# EAGLE design MSP-EXPG2_Rev.1.3 (EAGLE 5.01)

## Sheet 1 of 3
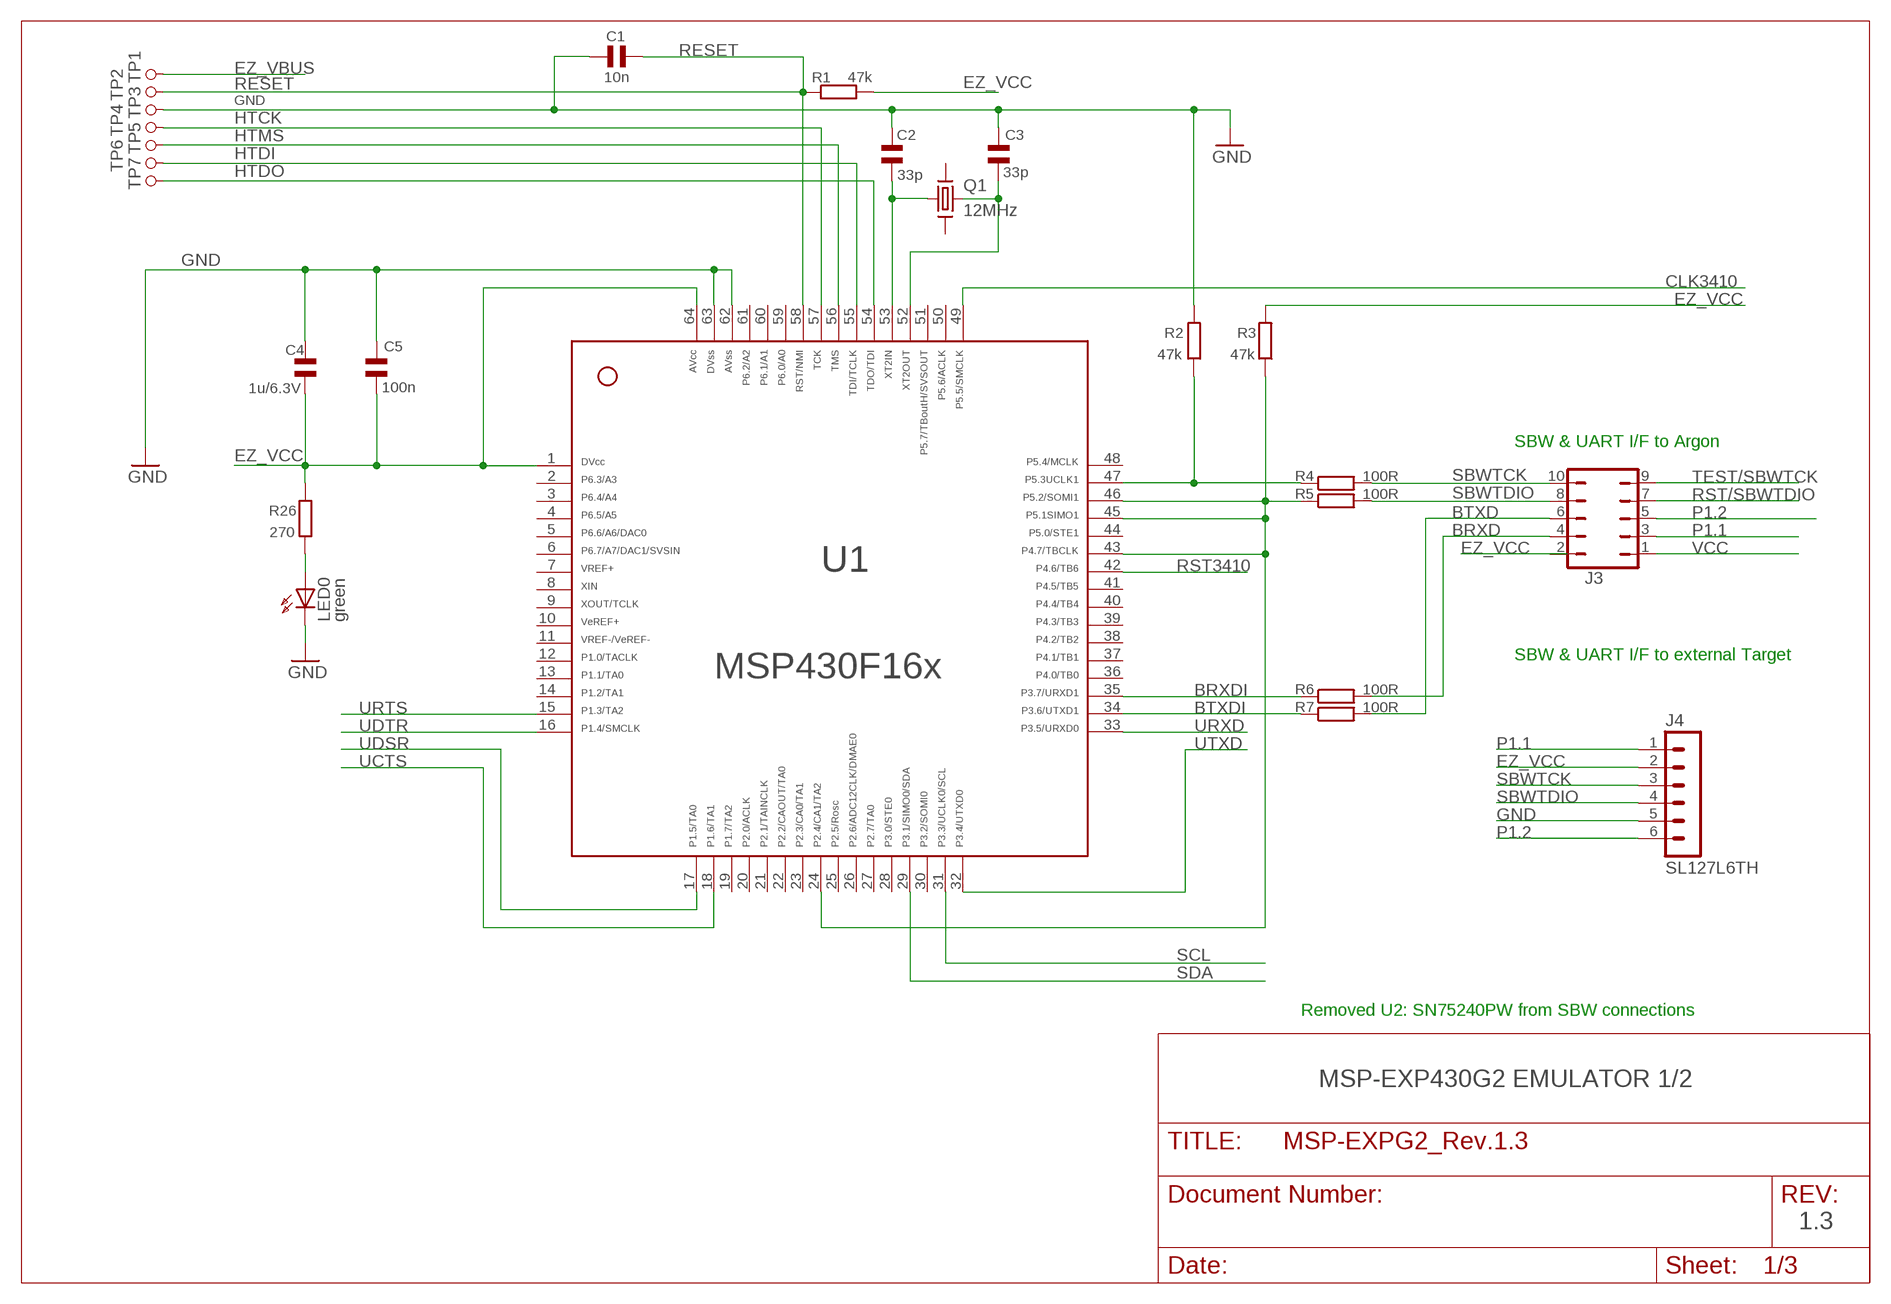
[diagram p0: schematic, sheet 1]

### Parts
C1  10n  C_SMD0402  [0402]
C2  33p  C_SMD0402  [0402]
C3  33p  C_SMD0402  [0402]
C4  1u/6.3V  C_SMD0603  [0603]
C5  100n  C_SMD0402  [0402]
J3  JP5Q  [JP5Q]
J4  SL127L6TH  [SL127L6_MPE]
LED0  green  LED_0603D0603  [DIODE0603]
Q1  12MHz  XTL_FT7AFT10A  [FT10A]
R1  47k  R_SMDR0402  [0402]
R2  47k  R_SMDR0402  [0402]
R3  47k  R_SMDR0402  [0402]
R4  100R  R_SMDR0402  [0402]
R5  100R  R_SMDR0402  [0402]
R6  100R  R_SMDR0402  [0402]
R7  100R  R_SMDR0402  [0402]
R26  270  R_SMDR0402  [0402]
TP1  TP05TP10  [TP10]
TP2  TP05TP10  [TP10]
TP3  TP05TP10  [TP10]
TP4  TP05TP10  [TP10]
TP5  TP05TP10  [TP10]
TP6  TP05TP10  [TP10]
TP7  TP05TP10  [TP10]
U1  F16X---PM64  [PM/PAG64]

### Nets
BRXD: J3.4 R6.2
BRXDI: R6.1 U1.35 ; also sheet 2
BTXD: J3.6 R7.2
BTXDI: R7.1 U1.34 ; also sheet 2
CLK3410: U1.49 ; also sheet 2
EZ_VBUS: TP1.1 ; also sheet 2
EZ_VCC: C4.2 C5.1 J3.2 J4.2 R1.2 R3.2 R26.2 U1.1 U1.64 ; also sheet 2
GND [Ground]: C1.2 C2.2 C3.2 C4.1 C5.2 J4.5 LED0.K(C) R2.2 TP3.1 U1.62 U1.63 ; also sheet 2,3
HTCK: TP4.1 U1.57
HTDI: TP6.1 U1.55
HTDO: TP7.1 U1.54
HTMS: TP5.1 U1.56
N$1: R2.1 R4.1 U1.47
N$2: R3.1 R5.1 U1.24 U1.43 U1.45 U1.46
N$19: LED0.A R26.1
P1.1: J3.3 J4.1 ; also sheet 3
P1.2: J3.5 J4.6 ; also sheet 3
RESET: C1.1 R1.1 TP2.1 U1.58 ; also sheet 2
RST3410: U1.42 ; also sheet 2
RST/SBWTDIO: J3.7 ; also sheet 3
SBWTCK: J3.10 J4.3 R4.2
SBWTDIO: J3.8 J4.4 R5.2
SCL: U1.31 ; also sheet 2
SDA: U1.29 ; also sheet 2
TEST/SBWTCK: J3.9 ; also sheet 3
UCTS: U1.18 ; also sheet 2
UDSR: U1.17 ; also sheet 2
UDTR: U1.16 ; also sheet 2
URTS: U1.15 ; also sheet 2
URXD: U1.33 ; also sheet 2
UTXD: U1.32 ; also sheet 2
VCC: J3.1 ; also sheet 3
XIN1: C3.1 Q1.P$3 U1.52
XOUT1: C2.1 Q1.P$1 U1.53
Unconnected: Q1.P$2(G2) Q1.P$4(G4) U1.2 U1.3 U1.4 U1.5 U1.6 U1.7 U1.8 U1.9 U1.10 U1.11 U1.12 U1.13 U1.14 U1.19 U1.20 U1.21 U1.22 U1.23 U1.25 U1.26 U1.27 U1.28 U1.30 U1.36 U1.37 U1.38 U1.39 U1.40 U1.41 U1.44 U1.48 U1.50 U1.51 U1.59 U1.60 U1.61

### Notes on the sheet
- SBW & UART I/F to Argon
- SBW & UART I/F to external Target
- Removed U2: SN75240PW from SBW connections
- MSP-EXP430G2 EMULATOR 1/2
- 1.3

## Sheet 2 of 3
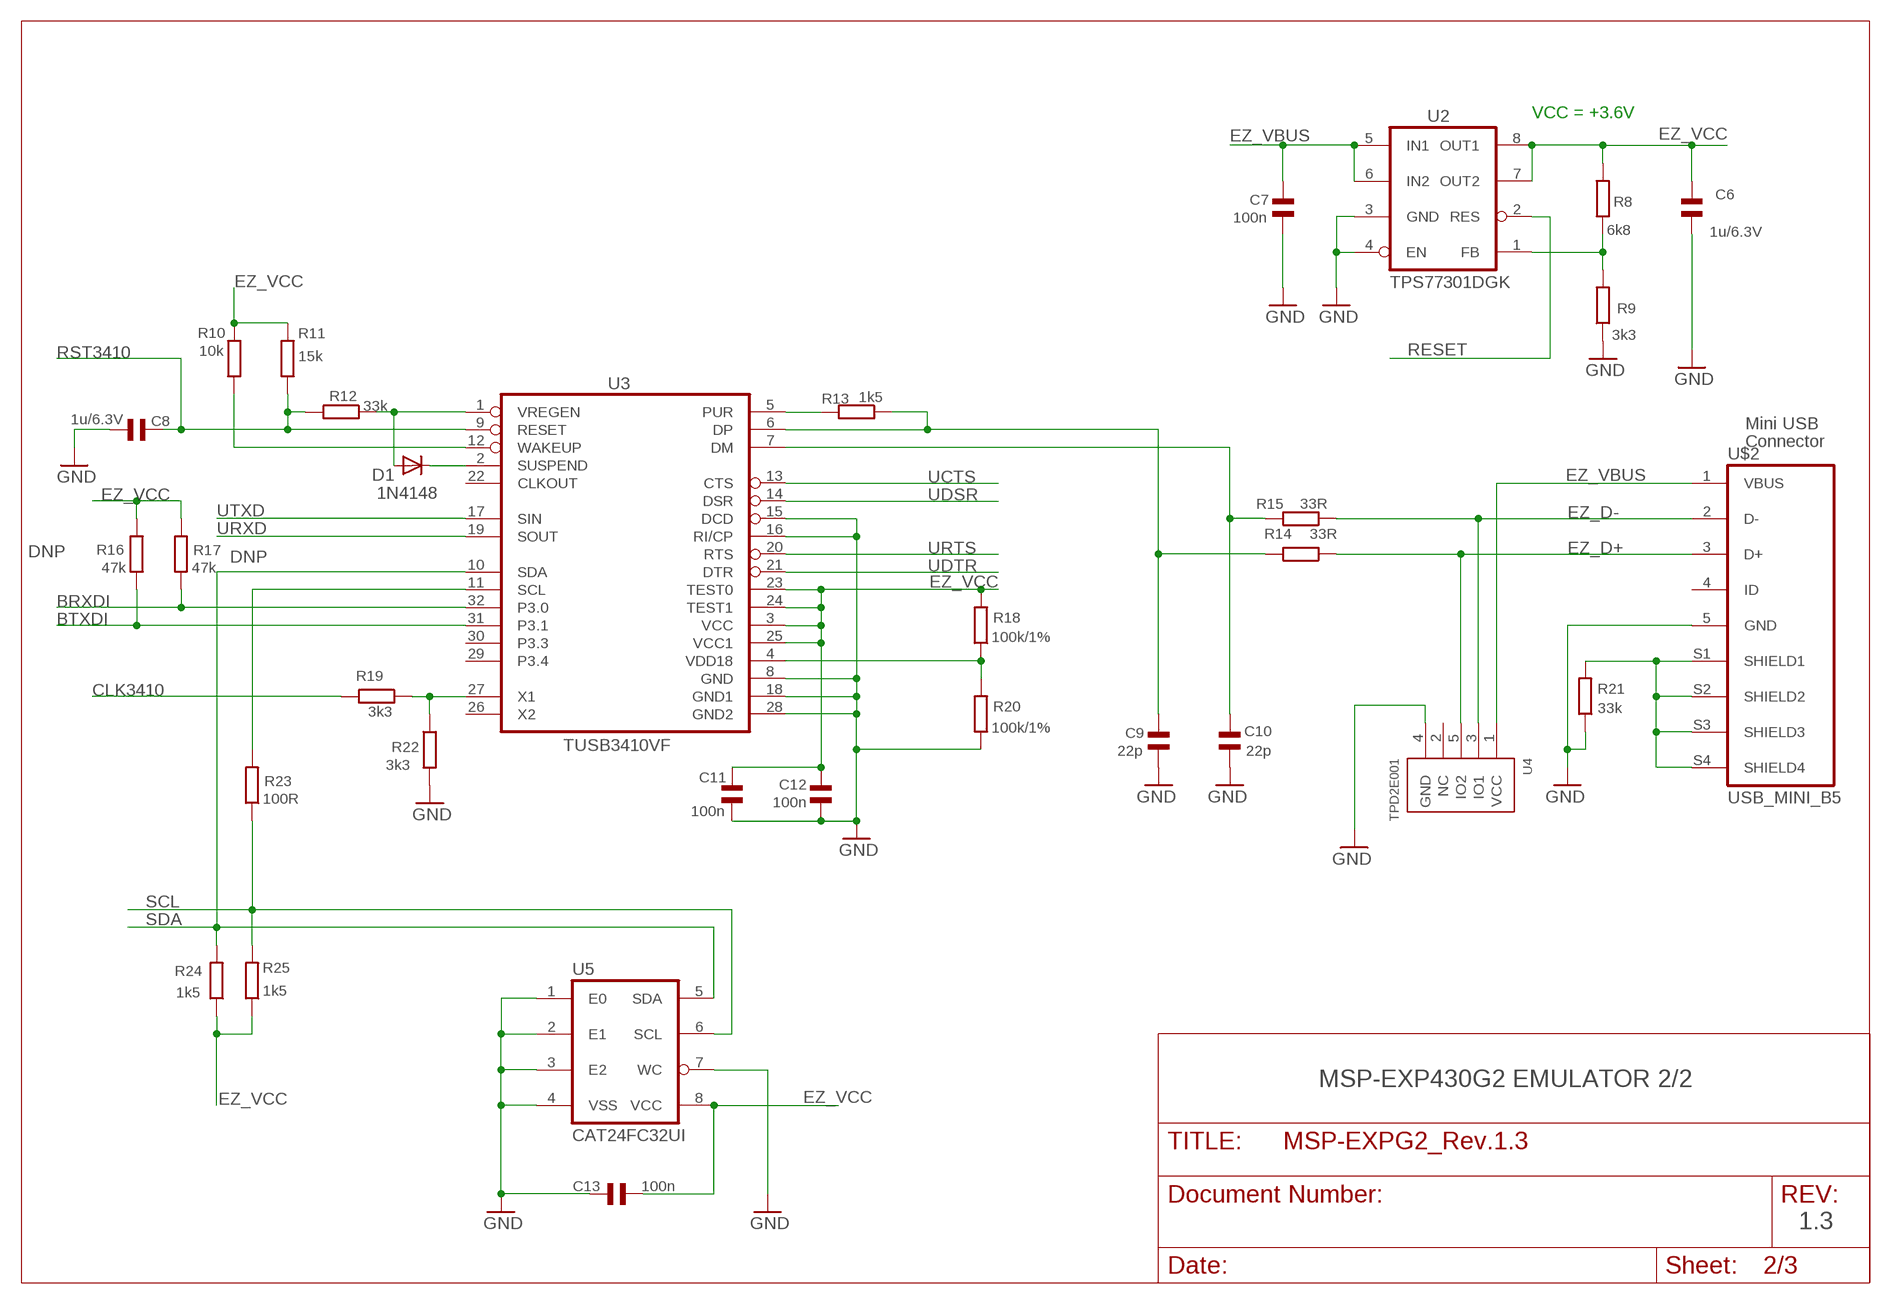
[diagram p1: schematic, sheet 2]

### Parts
C6  1u/6.3V  C_SMD0603  [0603]
C7  100n  C_SMD0402  [0402]
C8  1u/6.3V  C_SMD0603  [0603]
C9  22p  C_SMD0402  [0402]
C10  22p  C_SMD0402  [0402]
C11  100n  C_SMD0402  [0402]
C12  100n  C_SMD0402  [0402]
C13  100n  C_SMD0402  [0402]
D1  1N4148  DIODE-SOD110-R  [SOD110-R]
R8  6k8  R_SMDR0402  [0402]
R9  3k3  R_SMDR0402  [0402]
R10  10k  R_SMDR0402  [0402]
R11  15k  R_SMDR0402  [0402]
R12  33k  R_SMDR0402  [0402]
R13  1k5  R_SMDR0402  [0402]
R14  33R  R_SMDR0402  [0402]
R15  33R  R_SMDR0402  [0402]
R16  47k  R_SMDR0402  [0402]
R17  47k  R_SMDR0402  [0402]
R18  100k/1%  R_SMDR0402  [0402]
R19  3k3  R_SMDR0402  [0402]
R20  100k/1%  R_SMDR0402  [0402]
R21  33k  R_SMDR0402  [0402]
R22  3k3  R_SMDR0402  [0402]
R23  100R  R_SMDR0402  [0402]
R24  1k5  R_SMDR0402  [0402]
R25  1k5  R_SMDR0402  [0402]
U2  TPS77301DGK  TPS773XX  [MSOP8]
U3  TUSB3410VF  TUSB3410  [QFP32]
U4  TPD2E001  [TPD2E001-DRL]
U5  CAT24FC32UI  M24XXX  [TSSOP8]
U$2  USB_MINI_B5  [USB_MINI_B]

### Nets
BRXDI: R17.1 U3.32(P3.0) ; also sheet 1
BTXDI: R16.1 U3.31(P3.1) ; also sheet 1
CLK3410: R19.2 ; also sheet 1
EZ_D+: R14.1 U4.5(IO2) U$2.3(D+)
EZ_D-: R15.1 U4.3(IO1) U$2.2(D-)
EZ_VBUS: C7.2 U2.5(IN1) U2.6(IN2) U4.1(VCC) U$2.1(VBUS) ; also sheet 1
EZ_VCC: C6.1 C11.2 C12.2 C13.1 R8.2 R10.2 R11.2 R16.2 R17.2 R18.2 R24.1 R25.1 U2.7(OUT2) U2.8(OUT1) U3.3(VCC) U3.23(TEST0) U3.24(TEST1) U3.25(VCC1) U5.8(VCC) ; also sheet 1
GND [Ground]: C6.2 C7.1 C8.2 C9.1 C10.1 C11.1 C12.1 C13.2 R9.1 R20.1 R21.1 R22.2 U2.3(GND) U2.4(EN) U3.8(GND) U3.15(DCD) U3.16(RI/CP) U3.18(GND1) U3.28(GND2) U4.4(GND) U5.1(E0) U5.2(E1) U5.3(E2) U5.4(VSS) U5.7(WC) U$2.5(GND) ; also sheet 1,3
N$3: R19.1 R22.1 U3.27(X1)
N$4: R8.1 R9.2 U2.1(FB)
N$5: D1.A R12.1 U3.1(VREGEN)
N$6: D1.C U3.2(SUSPEND)
N$9: R10.1 U3.12(WAKEUP)
N$16: R23.2 U3.11(SCL)
N$17: R18.1 R20.2 U3.4(VDD18)
N$22: R21.2 U$2.S1(SHIELD1) U$2.S2(SHIELD2) U$2.S3(SHIELD3) U$2.S4(SHIELD4)
N$26: R13.2 U3.5(PUR)
N$30: C10.2 R15.2 U3.7(DM)
N$31: C9.2 R13.1 R14.2 U3.6(DP)
RESET: U2.2(RES) ; also sheet 1
RST3410: C8.1 R11.1 R12.2 U3.9(RESET) ; also sheet 1
SCL: R23.1 R25.2 U5.6(SCL) ; also sheet 1
SDA: R24.2 U3.10(SDA) U5.5(SDA) ; also sheet 1
UCTS: U3.13(CTS) ; also sheet 1
UDSR: U3.14(DSR) ; also sheet 1
UDTR: U3.21(DTR) ; also sheet 1
URTS: U3.20(RTS) ; also sheet 1
URXD: U3.19(SOUT) ; also sheet 1
UTXD: U3.17(SIN) ; also sheet 1
Unconnected: U3.22(CLKOUT) U3.26(X2) U3.29(P3.4) U3.30(P3.3) U4.2(NC)

### Notes on the sheet
- VCC = +3.6V
- Mini USB
- Connector
- DNP
- DNP
- MSP-EXP430G2 EMULATOR 2/2
- 1.3

## Sheet 3 of 3
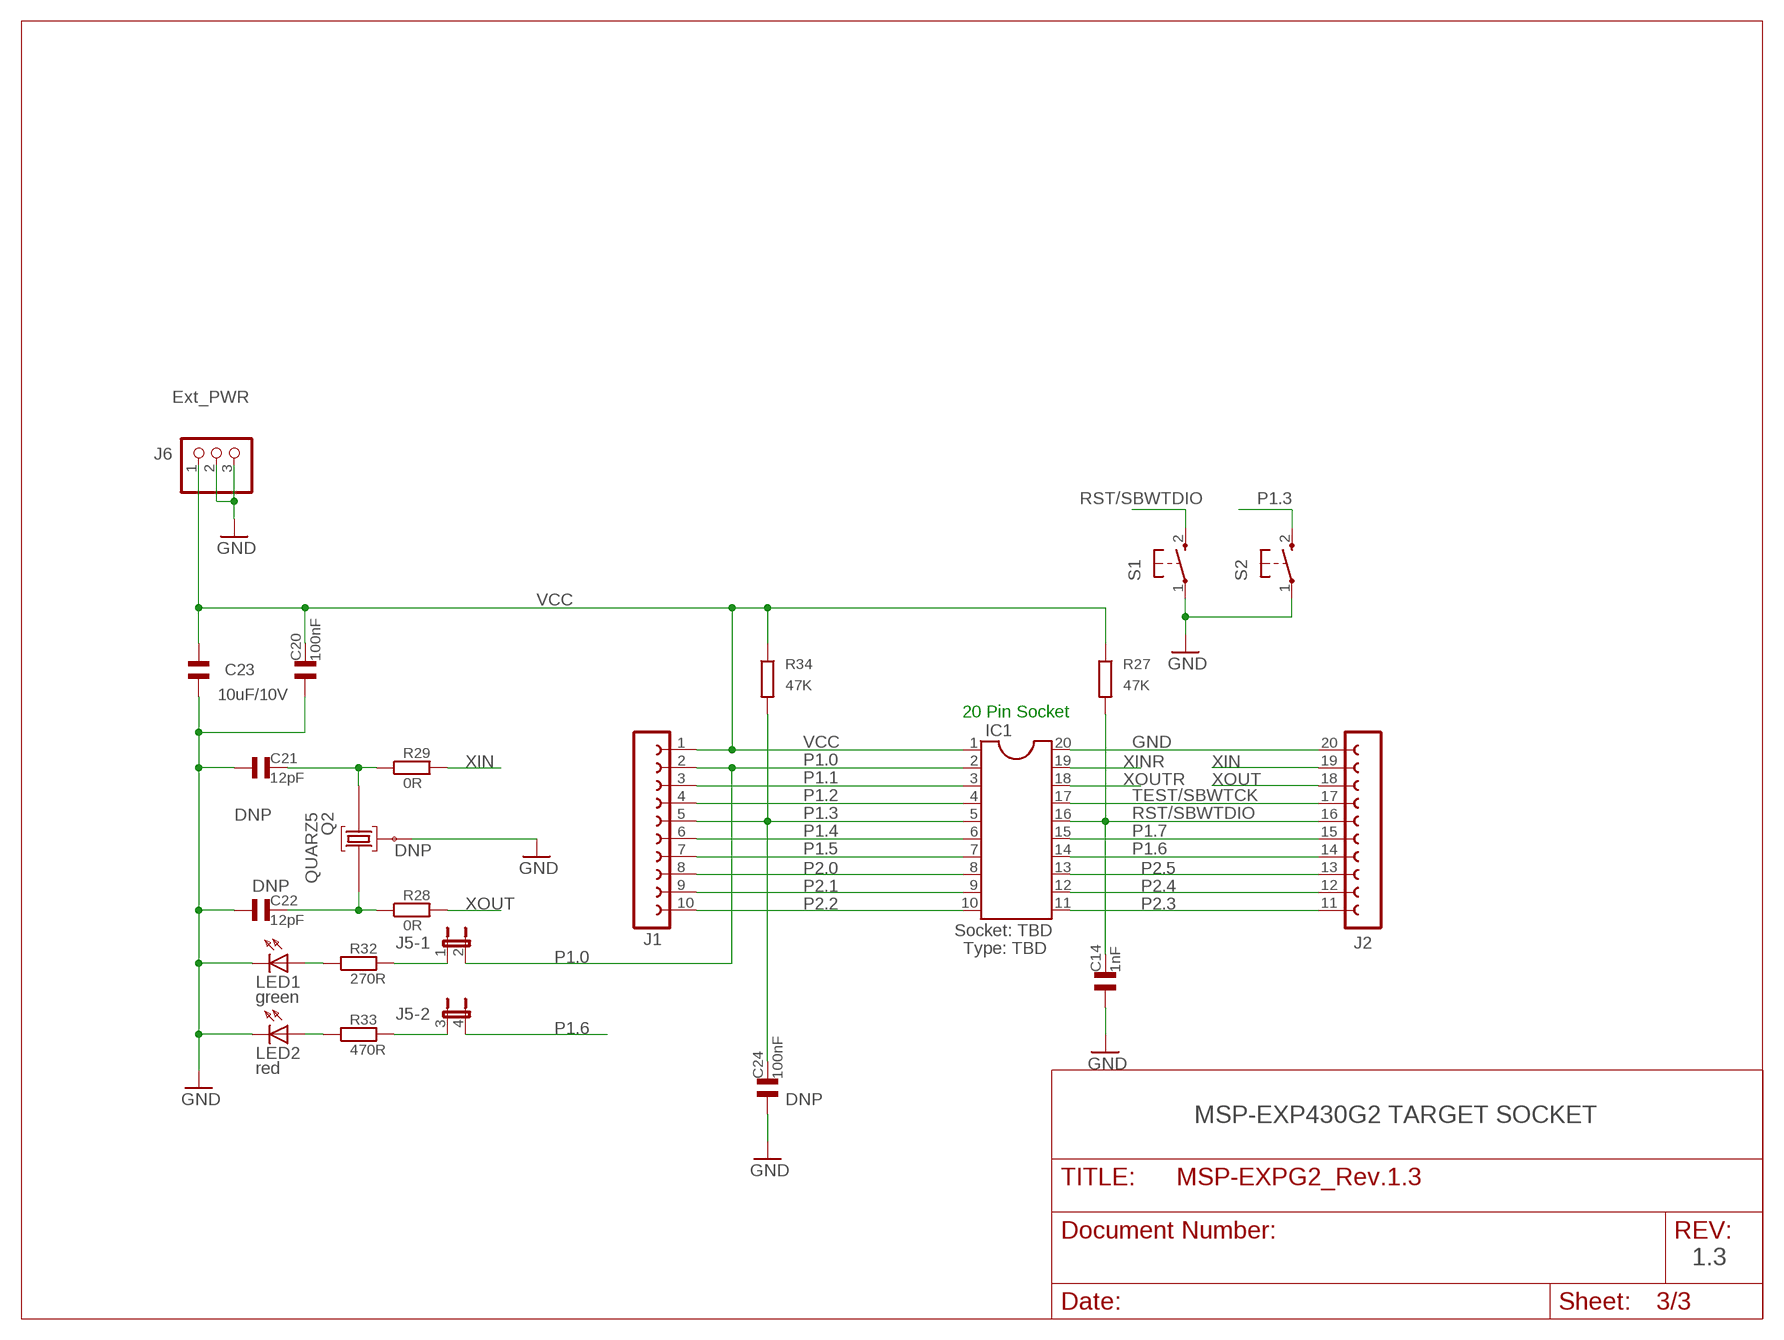
[diagram p2: schematic, sheet 3]

### Parts
C14  1nF  C_SMD0603  [0603]
C20  100nF  C_SMD0603  [0603]
C21  12pF  C_SMD0603  [0603]
C22  12pF  C_SMD0603  [0603]
C23  10uF/10V  C_0805  [0805]
C24  100nF  C_SMD0603  [0603]
IC1  DIL20  [DIL20]
J1  FE10L  [FE10]
J2  FE10H  [FE10H]
J5  JP2QE  [JP2Q]
J6  PINHD-1X3  [1X03]
LED1  green  LED_0603D0603  [DIODE0603]
LED2  red  LED_0603D0603  [DIODE0603]
Q2  QUARZ5  [QUARZ5]
R27  47K  R_SMDR0603  [0603]
R28  0R  R_SMDR0603  [0603]
R29  0R  R_SMDR0603  [0603]
R32  270R  R_SMDR0603  [0603]
R33  470R  R_SMDR0603  [0603]
R34  47K  R_SMDR0603  [0603]
S1  PB  [PBTH]
S2  PB  [PBTH]

### Nets
GND [Ground]: C14.1 C20.1 C21.1 C22.1 C23.1 C24.1 IC1.20 J2.20 J6.2 J6.3 LED1.K(C) LED2.K(C) Q2.GND@0 S1.1(P) S2.1(P) ; also sheet 1,2
N$14: LED2.A R33.1
N$15: J5.3 R33.2
N$33: J5.1 R32.2
N$34: LED1.A R32.1
P1.0: IC1.2 J1.2 J5.2
P1.1: IC1.3 J1.3 ; also sheet 1
P1.2: IC1.4 J1.4 ; also sheet 1
P1.3: C24.2 IC1.5 J1.5 R34.2 S2.2(S)
P1.4: IC1.6 J1.6
P1.5: IC1.7 J1.7
P1.6: IC1.14 J2.14 J5.4
P1.7: IC1.15 J2.15
P2.0: IC1.8 J1.8
P2.1: IC1.9 J1.9
P2.2: IC1.10 J1.10
P2.3: IC1.11 J2.11
P2.4: IC1.12 J2.12
P2.5: IC1.13 J2.13
RST/SBWTDIO: C14.2 IC1.16 J2.16 R27.2 S1.2(S) ; also sheet 1
TEST/SBWTCK: IC1.17 J2.17 ; also sheet 1
VCC: C20.2 C23.2 IC1.1 J1.1 J6.1 R27.1 R34.1 ; also sheet 1
XIN: J2.19 R29.2
XINR: C21.2 IC1.19 Q2.2 R29.1
XOUT: J2.18 R28.2
XOUTR: C22.2 IC1.18 Q2.1 R28.1

### Notes on the sheet
- Ext_PWR
- 20 Pin Socket
- DNP
- DNP
- DNP
- Socket: TBD
- Type: TBD
- DNP
- MSP-EXP430G2 TARGET SOCKET
- 1.3

## Power pins joined to a net without a drawn wire
ID: U$2.4(ID)

## Library data of the parts
C1-C13 = smd:C_SMD
C14 C20-C22 C24 = ssmd:C_SMD
C23 = ssmd:C_0805
D1 = diode:DIODE-: DIODE
IC1 = ic-package:DIL20: Dual In Line / Socket
J1 = sMSP430:FE10L
J2 = sMSP430:FE10H
J3 = sTI Lib:JP5Q: JUMPER
J4 = susbfet:SL127L6TH
J5 = stexas:JP2QE: JUMPER
J6 = pinhead:PINHD-1X3: PIN HEADER
LED0 LED1 LED2 = smd:LED_0603
Q1 = susbfet:XTL_FT7A
Q2 = sMSP430:QUARZ5
R1-R26 = smd:R_SMD
R27-R29 R32-R34 = ssmd:R_SMD
S1 S2 = electricalmeter:PB: OMRON SWITCH
TP1-TP7 = usbfet:TP05
U1 = TI_MSP430_v11:F16X---PM64: *** MSP430F16x *** PM64
U2 = gangprog:TPS773XX: VReg, 250mA
U3 = usbfet:TUSB3410: TI: TUSB3410: USB2UART-Controller
U4 = Project7264:TPD2E001: TPD2E001 ESD-protection diode array
U5 = usbfet:M24XXX: Serial EEProm: 24LC xxx
U$2 = susbfet:USB_MINI_B5

## Net classes
0 default: width 0.254 mm
1 Ground: width 0.1 mm, drill 0.2 mm

## Board
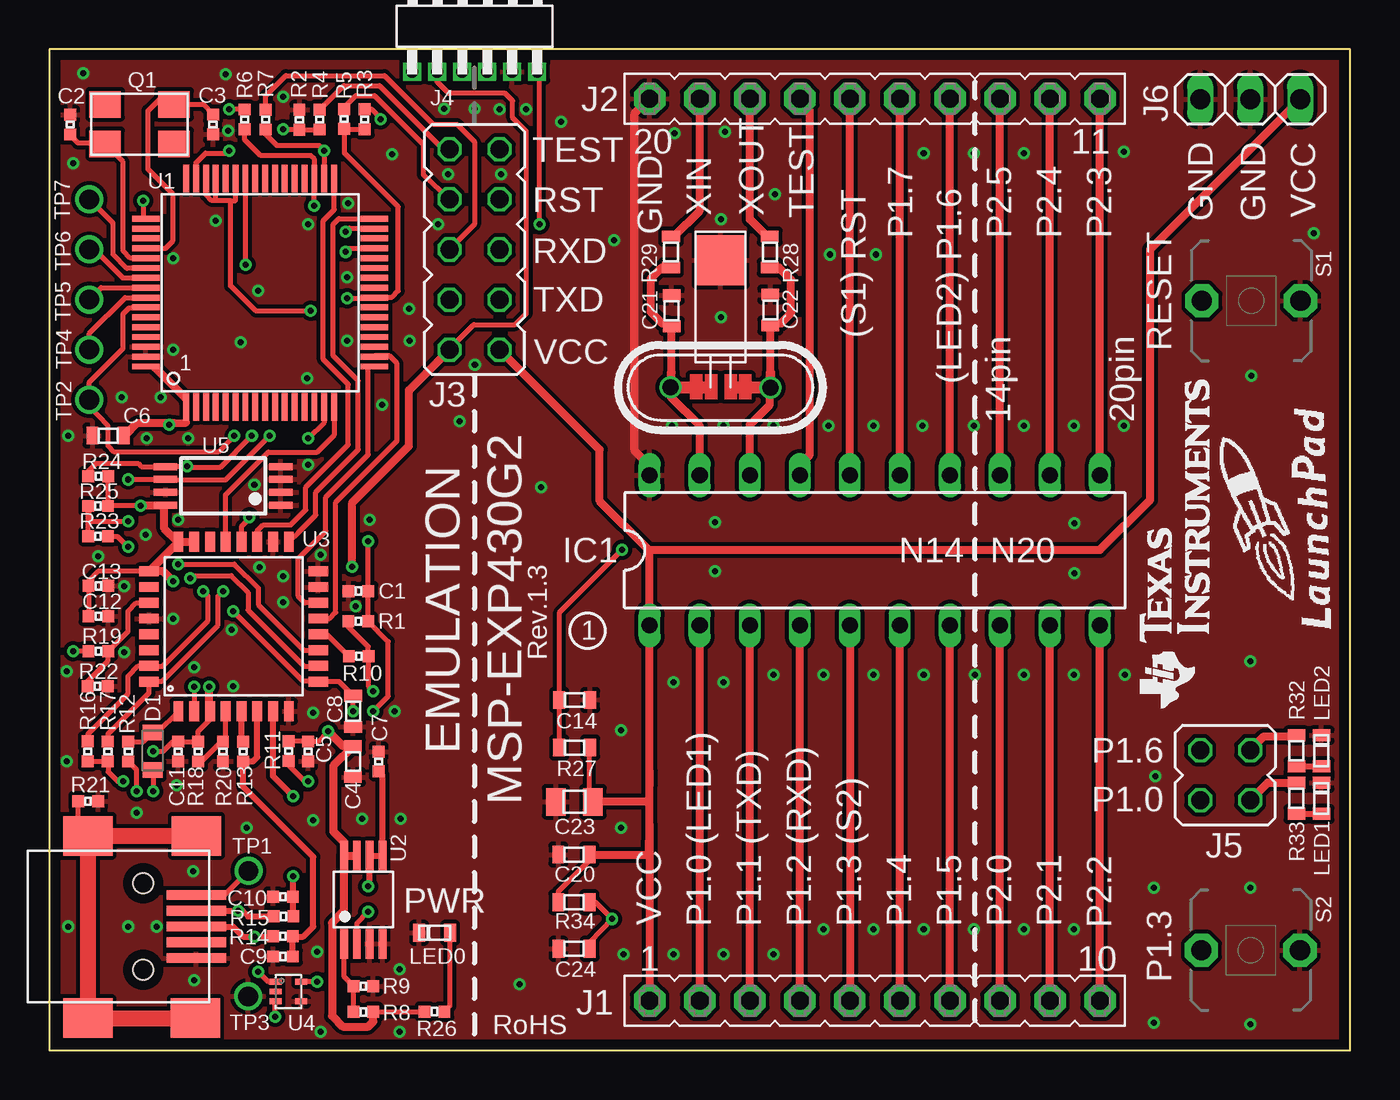
[diagram p3: board, top side]
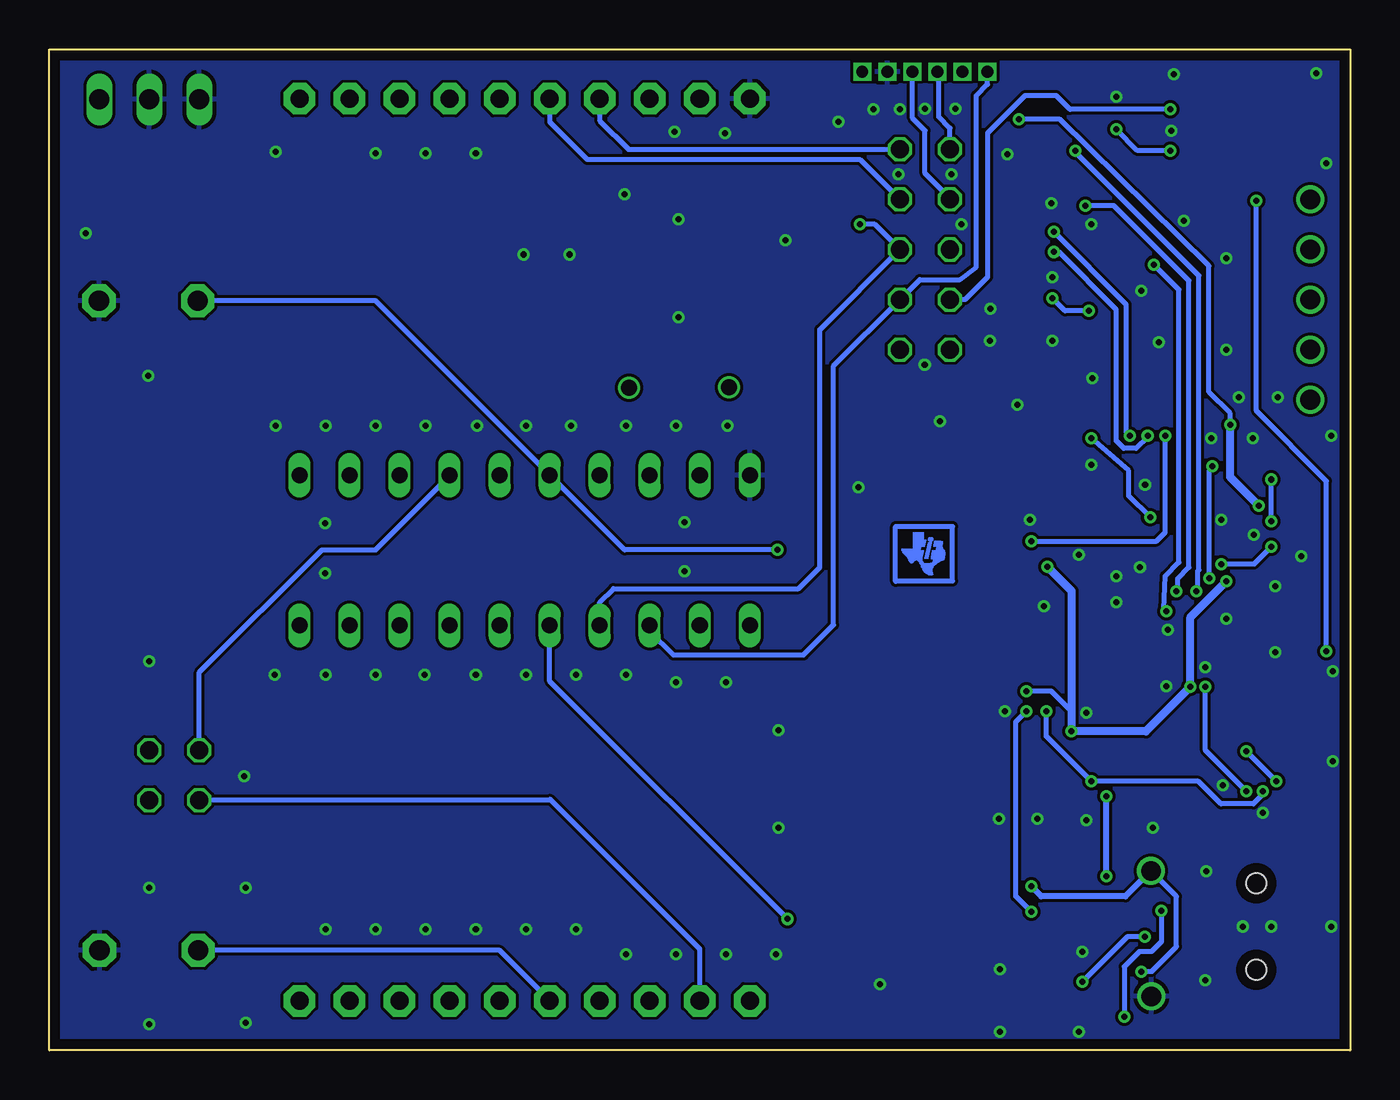
[diagram p4: board, bottom side, seen from below]

Size 66.04 x 50.8 mm. Coordinates in mm from the lower left corner, seen from the top.
Outline: 0,0 66.04,0 66.04,50.8 0,50.8 0,0
Copper layers (1*16): Top 0.035mm / dielectric 1.5mm / Bottom 0.035mm
Design rules "PCB-POOL *": minimum track width 6mil, minimum drill 12mil, track to track 6mil, track to pad 6mil, pad to pad 6mil, via to via 6mil, smd to smd 6mil, copper to edge 20mil, drill to drill 8mil, minimum pad ring 6mil, minimum via ring 6mil, stop-mask expansion 3mil, vias tented up to drill 0mil, thermal gap 8mil

### Footprints (pad centres in the part's own frame; a part is rotated, then mirrored left to right if it is on the bottom)
0402 = smd 0.6 x 0.6: 1 -0.501,0; 2 0.501,0
0603 = smd 0.6 x 0.9: 1 -0.787,0; 2 0.787,0
0805 = smd 1 x 1.4: 1 -0.94,0; 2 0.94,0
SOD110-R = smd 0.8 x 1: A 0.95,0; C -0.95,0
DIL20 = drill 0.813 long: 1 -11.43,-3.81; 2 -8.89,-3.81; 3 -6.35,-3.81; 4 -3.81,-3.81; 5 -1.27,-3.81; 6 1.27,-3.81; 7 3.81,-3.81; 8 6.35,-3.81; 9 8.89,-3.81; 10 11.43,-3.81; 11 11.43,3.81; 12 8.89,3.81; 13 6.35,3.81; 14 3.81,3.81; 15 1.27,3.81; 16 -1.27,3.81; 17 -3.81,3.81; 18 -6.35,3.81; 19 -8.89,3.81; 20 -11.43,3.81
FE10 = drill 0.914 pad 1.6 octagon: 1 -11.43,0; 2 -8.89,0; 3 -6.35,0; 4 -3.81,0; 5 -1.27,0; 6 1.27,0; 7 3.81,0; 8 6.35,0; 9 8.89,0; 10 11.43,0
FE10H = drill 0.914 pad 1.6 octagon: 11 -11.43,0; 12 -8.89,0; 13 -6.35,0; 14 -3.81,0; 15 -1.27,0; 16 1.27,0; 17 3.81,0; 18 6.35,0; 19 8.89,0; 20 11.43,0
JP5Q = drill 0.914 octagon: 1 -5.08,-1.27; 2 -5.08,1.27; 3 -2.54,-1.27; 4 -2.54,1.27; 5 0,-1.27; 6 0,1.27; 7 2.54,-1.27; 8 2.54,1.27; 9 5.08,-1.27; 10 5.08,1.27
SL127L6_MPE = drill 0.6 pad 0.889 square: 1 -3.17,0.07; 2 -1.91,0.07; 3 -0.63,0.07; 4 0.63,0.07; 5 1.91,0.07; 6 3.18,0.07
JP2Q = drill 0.914 octagon: 1 -1.27,-1.27; 2 -1.27,1.27; 3 1.27,-1.27; 4 1.27,1.27
1X03 = drill 1.016 long: 1 -2.54,0; 2 0,0; 3 2.54,0
DIODE0603 = smd 0.6 x 0.9: A -0.787,0; K 0.787,0
FT10A = smd 1.6 x 1.35: P$1 -1.75,-1; P$2 1.75,-1; P$3 1.75,1; P$4 -1.75,1
QUARZ5 = drill 0.813 round: 1 1.53,1.773; 2 1.52,-3.303 | smd 2.54 x 2.54: GND@0 -4.941,-0.762
PBTH = drill 1.016 pad 1.676 octagon: 1 -0.001,0.001; 2 5.001,0.001
TP10 = drill 1 pad 1.422 round: 1 0,0
PM/PAG64 = smd 1.4 x 0.3: 1 -5.88,3.67; 2 -5.88,3.17; 3 -5.88,2.67; 4 -5.88,2.17; 5 -5.88,1.67; 6 -5.88,1.17; 7 -5.88,0.67; 8 -5.88,0.17; 9 -5.88,-0.33; 10 -5.88,-0.83; 11 -5.88,-1.33; 12 -5.88,-1.83; 13 -5.88,-2.33; 14 -5.88,-2.83; 15 -5.88,-3.33; 16 -5.88,-3.83; 33 5.72,-3.83; 34 5.72,-3.33; 35 5.72,-2.83; 36 5.72,-2.33; 37 5.72,-1.83; 38 5.72,-1.33; 39 5.72,-0.83; 40 5.72,-0.33; 41 5.72,0.17; 42 5.72,0.67; 43 5.72,1.17; 44 5.72,1.67; 45 5.72,2.17; 46 5.72,2.67; 47 5.72,3.17; 48 5.72,3.67 | smd 0.3 x 1.4: 17 -3.83,-5.88; 18 -3.33,-5.88; 19 -2.83,-5.88; 20 -2.33,-5.88; 21 -1.83,-5.88; 22 -1.33,-5.88; 23 -0.83,-5.88; 24 -0.33,-5.88; 25 0.17,-5.88; 26 0.67,-5.88; 27 1.17,-5.88; 28 1.67,-5.88; 29 2.17,-5.88; 30 2.67,-5.88; 31 3.17,-5.88; 32 3.67,-5.88; 49 3.67,5.72; 50 3.17,5.72; 51 2.67,5.72; 52 2.17,5.72; 53 1.67,5.72; 54 1.17,5.72; 55 0.67,5.72; 56 0.17,5.72; 57 -0.33,5.72; 58 -0.83,5.72; 59 -1.33,5.72; 60 -1.83,5.72; 61 -2.33,5.72; 62 -2.83,5.72; 63 -3.33,5.72; 64 -3.83,5.72
MSOP8 = smd 0.4 x 1.5: 1 -0.978,-2.3; 2 -0.333,-2.3; 3 0.323,-2.3; 4 0.968,-2.3; 5 0.968,2.18; 6 0.323,2.18; 7 -0.333,2.18; 8 -0.978,2.18
QFP32 = smd 0.5 x 1: 1 -2.8,-4.3; 2 -2,-4.3; 3 -1.2,-4.3; 4 -0.4,-4.3; 5 0.4,-4.3; 6 1.2,-4.3; 7 2,-4.3; 8 2.8,-4.3; 17 2.8,4.3; 18 2,4.3; 19 1.2,4.3; 20 0.4,4.3; 21 -0.4,4.3; 22 -1.2,4.3; 23 -2,4.3; 24 -2.8,4.3 | smd 1 x 0.5: 9 4.3,-2.8; 10 4.3,-2; 11 4.3,-1.2; 12 4.3,-0.4; 13 4.3,0.4; 14 4.3,1.2; 15 4.3,2; 16 4.3,2.8; 25 -4.3,2.8; 26 -4.3,2; 27 -4.3,1.2; 28 -4.3,0.4; 29 -4.3,-0.4; 30 -4.3,-1.2; 31 -4.3,-2; 32 -4.3,-2.8
TPD2E001-DRL = smd 0.3 x 0.6: 1 -0.5,-0.65; 2 0,-0.65; 3 0.5,-0.65; 4 0.5,0.65; 5 -0.5,0.65
TSSOP8 = smd 1.2 x 0.35: 1 -2.925,0.975; 2 -2.925,0.325; 3 -2.925,-0.325; 4 -2.925,-0.975; 5 2.925,-0.975; 6 2.925,-0.325; 7 2.925,0.325; 8 2.925,0.975
USB_MINI_B = smd 0.5 x 3: 1 -1.6,8.55; 2 -0.8,8.55; 3 0,8.55; 4 0.8,8.55; 5 1.6,8.55 | smd 2 x 2.5: S1 -4.6,8.55; S2 -4.6,3.05; S3 4.65,3.05; S4 4.65,8.5 | hole 1.016: -2.2,5.85; 2.2,5.85

### Placement (x,y rotation side)
C1  15.69,23.31 180 top
C2  1.06,46.98 90 top
C3  8.31,46.99 270 top
C4  15.42,14.66 90 top
C5  13.14,15.17 270 top
C6  2.98,31.2 180 top
C7  16.72,14.66 270 top
C8  15.43,17.2 270 top
C9  11.86,4.76 0 top
C10  11.86,7.8 0 top
C11  6.55,15.17 90 top
C12  2.49,22.03 180 top
C13  2.49,23.57 0 top
C14  26.67,17.78 180 top
C20  26.63,9.94 0 top
C21  31.6,37.54 270 top
C22  36.6,37.57 270 top
C23  26.66,12.61 0 top
C24  26.64,5.16 0 top
D1  5.25,15.18 90 top
IC1  41.91,25.37 0 top
J1  41.91,2.51 0 top
J2  41.91,48.3 180 top
J3  21.59,40.64 90 top
J4  21.59,49.59 0 top
J5  59.69,13.97 90 top
J6  60.96,48.26 180 top
LED0  19.56,5.97 180 top
LED1  64.58,12.79 90 top
LED2  64.58,15.2 90 top
Q1  4.58,47 0 top
Q2  34.84,35.16 270 top
R1  15.68,21.77 180 top
R2  12.7,47.22 90 top
R3  16.01,47.25 90 top
R4  13.72,47.23 90 top
R5  14.97,47.26 90 top
R6  9.91,47.24 90 top
R7  10.98,47.23 90 top
R8  15.95,1.95 0 top
R9  15.95,3.26 180 top
R10  15.71,19.99 0 top
R11  12.15,15.19 90 top
R12  4.02,15.16 270 top
R13  9.84,15.16 90 top
R14  11.87,5.79 0 top
R15  11.89,6.8 0 top
R16  1.95,15.18 270 top
R17  2.97,15.17 270 top
R18  7.56,15.16 90 top
R19  2.49,20.26 180 top
R20  8.82,15.17 90 top
R21  1.98,12.65 180 top
R22  2.46,18.47 0 top
R23  2.48,26.09 0 top
R24  2.49,29.13 180 top
R25  2.48,27.62 180 top
R26  19.56,1.97 180 top
R27  26.67,15.37 180 top
R28  36.58,40.51 90 top
R29  31.56,40.51 90 top
R32  63.31,12.79 90 top
R33  63.31,15.2 90 top
R34  26.63,7.52 0 top
S1  63.52,38.03 180 top
S2  63.49,5.08 180 top
TP1  10.11,9.11 90 top
TP2  2.03,33.02 90 top
TP3  10.09,2.74 90 top
TP4  2.03,35.56 90 top
TP5  2.03,38.1 90 top
TP6  2.03,40.64 90 top
TP7  2.03,43.18 90 top
U1  10.63,38.53 90 top
U2  15.95,7.71 0 top
U3  9.36,21.51 0 top
U4  12.14,2.99 270 top
U5  8.83,28.65 180 top
U$1  [LOGO16_TPLACE]  59.05,17.27 90 top
U$2  -1.08,6.29 270 top
U$5  [TILOGO_SMALL]  21.53,25.46 0 bottom
U$7  [LAUNCHPAD3]  65.07,21.37 90 top

### Tracks (layer width: path | path; a pad name or v marks a point on that pad's centre or on a via)
BRXD  (via drill 0.3)
  Top 0.254: R6.2 9.91,47.75 | 9.91,47.75 9.91,47.88 | 9.91,47.75 9.9,47.75 v9.14,47.75
  Bottom 0.254: v9.14,47.75 14.22,47.75 14.92,48.45 16.51,48.45 18.41,46.55 18.41,39.24 19.56,38.1 J3.4
BRXDI  (via drill 0.3)
  Top 0.254: R17.1 2.98,15.69 2.98,16.07 5.06,18.14 U3.32 5.08,18.73 5.73,18.73 8.57,21.58 8.57,23.05 v8.83,23.3 | v13.45,42.86 U1.35 13.46,45.21 13.27,45.4 10.73,45.4 9.91,46.22 R6.1
  Bottom 0.254: v8.83,23.3 8.76,23.3 8.76,23.94 8.19,24.51 8.19,39.06 11.94,42.8 12,42.86 v13.45,42.86
BTXD
  Top 0.254: R7.2 10.99,48.45 12,49.47 17.02,49.47 19.49,46.99 20.7,46.99 21.59,46.1 21.59,41.91 J3.6
BTXDI  (via drill 0.3)
  Top 0.254: R16.1 1.97,15.7 1.97,16.07 4,18.1 4,18.99 4.53,19.51 U3.31 5.08,19.49 5.75,19.49 8.06,21.81 8.06,23.05 v7.81,23.3 | U1.34 v13.96,45.66 13.7,45.91 11.56,45.91 10.99,46.48 R7.1 | U1.34
  Bottom 0.254: v7.81,23.3 7.75,23.3 7.75,24.32 7.68,24.38 7.68,39.32 13.72,45.34 13.96,45.58 v13.96,45.66
CLK3410  (via drill 0.3)
  Top 0.254: R19.2 v1.21,20.26 | U1.49 4.91,42.18 4.89,42.16 4.76,42.29 v4.76,43.12
  Bottom 0.254: v1.21,20.26 1.21,28.89 4.76,32.45 v4.76,43.12
EZ_D+  (via drill 0.3)
  Top 0.254: U4.5 13.65,3.49 v13.59,3.49
  Top 0.305: U$2.3 9.34,6.29 9.84,5.78 v10.43,5.78 R14.1
  Bottom 0.254: v13.59,3.49 11.3,5.78 v10.43,5.78
EZ_D-  (via drill 0.3)
  Top 0.254: U4.3 11.47,2.47 v11.47,1.71
  Top 0.305: U$2.2 v9.59,7.09 9.8,7.09 10.1,6.79 R15.1
  Bottom 0.254: v11.47,1.71 11.47,4.25 10.71,5.02 10.1,5.02 9.59,5.52 v9.59,7.09
EZ_VBUS  (via drill 0.3)
  Top 0.254: TP1.1 8.89,7.89 U$2.1 | U4.1 11.12,3.49 v10.6,4
  Top 0.305: C7.2 16.91,13.96 U2.5 U2.6 16.27,8.4 v16.19,8.32
  Bottom 0.254: v10.6,4 10.1,4 8.83,5.27 8.83,7.82 TP1.1
  Bottom 0.305: v16.19,8.32 15.68,7.81 11.41,7.81 TP1.1
EZ_VCC  (via drill 0.3)
  Top 0.254: 14.95,9.86 U2.8 14.97,10.56 | 8.16,16.8 U3.3 | 8.16,16.8 7.56,16.19 R18.2 | R18.2 | R18.2 C11.2 6.28,15.67 5.78,15.18 v5.27,15.18 | R16.2 R17.2 2.98,14.66 2.98,14.13 3.47,13.65 v3.75,13.65 | 8.16,16.8 8.12,16.84 | v14.16,16.19 13.64,15.67 C5.1 13.13,15.69 R11.2 | 14.91,15.44 C4.2 | R1.2 15.18,21.5 16.19,20.48 16.19,20.01 R10.2 16.22,20 16.22,18.45 v16.45,18.22 | C12.2 C13.1 1.99,23.84 2.47,24.31 U3.25 | R25.1 | R25.1 R24.1 | U1.1 6.97,32.67 | C6.1 4.32,31.81 6.1,31.83 | 6.95,31.85 6.95,32.64 U1.1 | v4.64,27.62 R25.1 | 5.86,27.62 U5.8 5.84,27.61 | U3.24 6.51,25.81 | v6.1,31.75 6.33,31.83 | U1.1 6.89,33.11 | 5.37,34.64 U1.64 | R3.2 16.38,47.75 16.83,47.31 v16.83,47.24 | R26.2 19.04,1.95 R8.2 | J4.2 19.68,49.15 20.27,48.56 23.14,48.56 23.52,48.18 23.52,47.32 24.22,46.62 24.22,37.4 23.65,36.83 21.55,36.83 20.31,35.59 20.32,35.57 J3.2
  Top 0.406: R8.2 16.45,1.46 16.19,1.21 14.9,1.21 14.35,1.75 14.35,6.48 14.95,7.07 14.95,9.86 | U2.8 U2.7 | 8.12,16.84 v8.12,18.45 | v14.16,16.19 14.91,15.44 | C4.2 14.41,14.44 14.41,11.11 14.97,10.56 | U3.25 U3.24 U3.23 | U3.25 5.78,24.32 v6.29,23.81 | 6.1,31.83 6.95,31.85 | 5.86,27.62 v4.64,27.62 | 6.51,25.81 5.84,26.48 5.84,27.61 | 6.33,31.83 4.45,31.81 3.83,31.2 C6.1 | 6.89,33.11 5.37,34.64 | J3.2 18.26,33.5 18.26,30.68 15.38,27.8 v15.38,24.54
  Bottom 0.254: v3.75,13.65 v5.27,15.18 | v14.16,16.19 14.16,17.21 15.18,18.22 v16.45,18.22 | v16.83,47.24 14.73,47.24 7.18,39.81 7.18,33.4 6.1,32.32 v6.1,31.75
  Bottom 0.406: v6.29,23.81 8.12,21.98 v8.12,18.45 10.38,16.19 v14.16,16.19 14.14,16.17 | v6.1,31.75 6.1,29.09 v4.64,27.62 | 14.14,16.17 14.14,16.14 | v15.38,24.54 14.14,23.3 14.14,16.17
GND  (via drill 0.3)
  Top 0.406: IC1.20 30.42,29.72 29.72,30.42 29.72,47.56 30.42,48.26 30.42,48.35 | 30.35,48.22 J2.20
  other vias: 4,6.29 5.46,6.29 4.45,12.06 3.81,20.19 3.81,23.56 2.48,25.08 6.54,26.92 10.67,24.51 11.87,22.73 11.87,24.07 9.33,18.48 13.4,17.14 6.29,21.91 7.37,19.43 0.95,31.18 3.68,33.15 5.65,33.15 6.29,35.56 7.05,31.05 0.89,19.24 0.89,14.67 6.29,40.2 9.72,35.94 15.11,36 10.6,38.54 8.45,42.1 13.14,41.91 15.11,39.24 7.3,9.08 7.37,3.56 13.78,0.95 17.78,0.95 17.78,4.13 13.59,5.02 13.4,11.68 10.03,11.3 15.88,11.75 34.1,37.21 34.23,31.69 17.84,11.75 29.15,4.89 31.69,4.89 34.23,4.89 36.77,4.89 39.31,6.16 41.85,6.16 44.39,6.16 46.93,6.16 49.47,6.16 52.01,6.16 31.69,18.67 34.23,18.67 36.77,19.05 39.31,19.05 41.85,19.05 44.39,19.05 46.98,19.05 49.47,19.05 52.01,19.05 54.61,19.05 54.55,31.69 52.01,31.69 49.47,31.69 46.93,31.69 44.32,31.69 41.85,31.69 39.56,31.69 36.77,31.69 56.07,8.26 0.95,6.29 9.27,21.34 60.96,8.26 56.13,13.91 60.96,1.33 56.07,1.4 31.62,31.69 39.62,40.39 41.97,40.39 44.39,45.53 46.93,45.53 49.47,45.53 54.55,45.59 6.48,13.46 10.41,28.7 13.14,29.72 13.78,25.15 4.89,26.16 34.1,42.16 34.29,46.61 31.75,46.55 23.88,3.37 29.02,16.26 61.02,34.23 64.2,41.47 24.96,28.57 28.68,41.11 25.97,47.12 17.4,45.47 15.56,22.54 4.95,31.05 13.08,34.1 15.18,42.99 1.21,45.02 1.71,49.59 8.95,49.53 11.87,48.39 9.08,46.67 16.26,26.92 17.53,17.21 16.89,32.77 18.29,36 19.75,41.91 22.92,44.45 20.26,44.45 24.19,47.75 21.59,47.78 22.86,47.76 21.6,34.8 20.83,31.93 18.28,37.64 60.96,19.75 52.04,26.75 20.05,47.78 29.02,11.3 52.04,24.21 33.78,26.8 33.78,24.32 36.83,43.43
  pour Top (isolate 0.2, rank 2): 0,0 66.04,0 66.04,50.8 0,50.8
  pour Bottom (rank 2): 0,0 66.04,0 66.04,50.8 0,50.8
HTCK
  Top 0.254: U1.57 3.85,38.2 2.03,36.39 TP4.1
HTDI
  Top 0.254: U1.55 3.72,39.2 2.54,40.39 2.28,40.39 TP6.1
HTDO
  Top 0.254: TP7.1 3.24,41.97 3.24,40.39 3.94,39.69 4.89,39.69 U1.54
HTMS
  Top 0.254: U1.56 2.63,38.7 TP5.1
N$1  (via drill 0.3)
  Top 0.254: R4.1 R2.1 12.69,46.74 v11.87,46.74 | U1.47 7.46,45.05 7.94,45.53 9.02,45.53 v9.14,45.66
  Bottom 0.254: v9.14,45.66 10.79,45.66 v11.87,46.74
N$2  (via drill 0.3)
  Top 0.254: U1.46 7.96,43.41 8.26,43.12 8.45,43.12 | 9.21,43.12 8.45,43.12 | U1.43 9.46,44.2 9.46,43.12 9.21,43.12 | U1.45 8.46,43.13 8.45,43.12 | 9.21,43.12 9.21,38.8 10.48,37.53 v13.27,37.53 | 16.51,38.22 16.51,38.23 | 16.51,38.22 U1.24 16.53,38.23 17.4,38.23 17.72,38.54 17.72,42.8 14.98,45.53 14.98,46.75 | v15.11,38.16 16.45,38.16 16.51,38.22 | 14.98,46.75 R3.1 | 14.98,46.75 R5.1
  Bottom 0.254: v13.27,37.53 14.48,37.53 v15.11,38.16
N$3
  Top 0.254: R22.1 1.97,18.48 1.97,18.76 2.99,19.78 R19.1 4,21.27 4,22.29 4.42,22.71 U3.27
N$4
  Top 0.254: U2.1 14.97,3.73 R9.2 R8.1
N$5
  Top 0.254: R12.1 4.78,15.66 D1.A 5.48,16.13 U3.1
N$6  (via drill 0.3)
  Top 0.254: U3.2 7.36,18.19 v7.35,18.45 | v5.27,13.14 5.27,14.21 D1.C
  Bottom 0.254: v7.35,18.45 7.35,15.23 v5.27,13.14
N$9
  Top 0.254: R10.1 14.09,21.11 U3.12
N$14
  Top 0.305: R33.1 LED2.A
N$15
  Top 0.406: J5.3 61.66,15.94 63.44,15.94 63.39,15.99 R33.2
N$16  (via drill 0.3)
  Top 0.254: U3.11 12.92,20.31 10.6,22.62 10.6,23.47 9.4,24.68 v6.54,24.68 | R23.2 3,26.07 3.47,26.07 3.98,25.57 v4,25.57
  Bottom 0.254: v4,25.57 4.89,24.68 v6.54,24.68
N$17
  Top 0.254: R18.1 7.73,14.66 8.73,15.67 R20.2 8.96,15.81 U3.4
N$18
  Bottom 0.254: 23.08,23.8 23.08,26.58 20.19,26.58 20.19,23.81 23.08,23.8
N$19
  Top 0.254: R26.1 20.34,2.25 LED0.A
N$22
  Top 0.254: R21.2 1.48,11.38 U$2.S2
  Top 0.813: U$2.S4 U$2.S3 U$2.S2 U$2.S1
N$26
  Top 0.305: U3.5 9.76,15.75 R13.2
N$30  (via drill 0.3)
  Top 0.305: R15.2 12.39,7.78 C10.2 12.38,7.82 v12.38,8.83 | U3.7 11.36,13.91 v12.38,12.89
  Bottom 0.305: v12.38,8.83 v12.38,12.89
N$31
  Top 0.305: C9.2 R14.2 12.89,5.78 13.4,6.29 13.4,9.82 9.84,13.37 R13.1 10.35,14.67 10.56,14.88 U3.6
N$33
  Top 0.406: J5.1 61.85,13.59 61.85,13.58 R32.2
N$34
  Top 0.305: R32.1 LED1.A
P1.0
  Top 0.406: J1.2 IC1.2
  Bottom 0.254: 33.02,2.41 J1.2 33.02,5.14 40.58,12.7 40.61,12.73 40.64,12.73 40.64,12.7 J5.2 | IC1.2 33.02,21.59
P1.1
  Top 0.406: J1.3 IC1.3
  Bottom 0.254: 35.56,21.53 IC1.3 35.56,21.27 34.35,20.07 27.75,20.07 26.23,21.59 26.23,34.73 J3.3 21.84,39.12 19.81,39.12 18.99,39.75 18.99,48.45 18.41,49.02 J4.1
P1.2  (via drill 0.3)
  Top 0.254: v24.89,41.91 24.89,49.28 J4.6
  Top 0.406: J1.4 IC1.4
  Bottom 0.254: J1.4 38.1,2.48 | IC1.4 38.1,22.73 37.4,23.43 28,23.43 26.92,24.51 26.92,36.58 J3.5 24.13,41.91 v24.89,41.91
P1.3  (via drill 0.3)
  Top 0.254: C24.2 27.44,5.52 v28.57,6.67 27.72,7.52 R34.2
  Top 0.406: 40.64,2.64 J1.5 IC1.5
  Bottom 0.254: v28.57,6.67 40.64,18.73 IC1.5 | J1.5 40.64,2.54 43.18,5.08 S2.2
P1.4
  Top 0.406: J1.6 IC1.6
P1.5
  Top 0.406: J1.7 IC1.7
P1.6
  Top 0.406: IC1.14 J2.14
  Bottom 0.254: 45.66,48.2 J2.14 45.72,48.26 | IC1.14 45.72,29.08 45.78,29.08 49.47,25.4 52.2,25.4 58.42,19.18 J5.4
  Bottom 0.305: 45.66,48.2 45.72,48.2
P1.7
  Top 0.406: IC1.15 J2.15
P2.0
  Top 0.406: J1.8 IC1.8
P2.1
  Top 0.406: J1.9 IC1.9
P2.2
  Top 0.406: J1.10 IC1.10
P2.3
  Top 0.406: IC1.11 J2.11
P2.4
  Top 0.406: IC1.12 J2.12
P2.5
  Top 0.406: IC1.13 J2.13
RESET  (via drill 0.3)
  Top 0.254: v16.45,17.21 17.21,17.97 17.21,20.75 R1.1 16.19,21.78 C1.1 v16.19,25.84 | v16.19,7.02 15.62,6.45 U2.2 | U1.58 4.2,37.71 4.18,37.68 4.05,37.68 3.75,37.38 3.75,35.62 2.03,33.91 TP2.1 2.03,33 2.03,32.7 2.98,31.69 2.98,30.67 3.3,30.35 8.57,30.35 v9.4,31.18
  Bottom 0.254: v16.45,17.21 16.98,16.68 16.98,7.81 v16.19,7.02 | v16.19,25.84 9.84,25.84 9.4,26.29 v9.4,31.18
RST3410  (via drill 0.3)
  Top 0.254: R11.1 12.13,14.67 12.13,14.49 12.97,13.65 v13.14,13.65 | v15.43,17.21 C8.1 14.7,18.71 U3.9 13.64,18.73 12.89,18.73 v9.34,22.29 | R12.2 4.43,14.24 v4.43,13.14 | U1.42 9.96,39.87 v9.97,39.88
  Bottom 0.254: v15.43,17.21 15.43,15.94 v13.14,13.65 7.71,13.65 6.57,12.51 4.92,12.51 4.43,12.99 v4.43,13.14 | v9.97,39.88 8.7,38.61 8.7,24.77 9.4,24.07 9.46,22.42 v9.34,22.29
RST/SBWTDIO  (via drill 0.3)
  Top 0.254: R27.2 25.91,15.37 25.91,17.78 | 25.91,17.78 C14.2 | 25.91,17.78 25.91,22.23 v29.08,25.4
  Top 0.406: IC1.16 J2.16
  Bottom 0.254: J3.7 24.89,45.21 38.73,45.21 40.64,47.12 J2.16 | S1.2 49.47,38.04 40.64,29.21 | 40.62,29.21 40.58,29.21 | 40.62,29.21 IC1.16 40.64,29.21 | 40.64,29.21 40.62,29.21 | v29.08,25.4 36.83,25.4 40.64,29.21
SBWTCK
  Top 0.254: R4.2 14.95,48.96 16.76,48.96 20,45.72 J3.10
  Bottom 0.254: J3.10 20.32,46.8 20.89,47.37 20.89,49.59 J4.3
SBWTDIO
  Top 0.254: R5.2 14.99,47.78 14.99,47.88 15.56,48.45 16.51,48.45 18.99,45.97 18.99,44.45 J3.8
  Bottom 0.254: J4.4 22.22,47.3 21.59,46.67 21.59,44.5 20.32,43.23 J3.8
SCL  (via drill 0.3)
  Top 0.254: R23.1 R25.2 1.99,27.61 1.99,26.86 v4,26.86 | v4,28.97 U5.6 5.92,28.96 8.95,28.96 v11.18,31.18 | U1.31 16.51,41.72 15.24,41.72 v15.05,41.53
  Bottom 0.254: v4,26.86 v4,28.97 | v11.18,31.18 11.37,31.37 11.37,37.85 v15.05,41.53
SDA  (via drill 0.3)
  Top 0.254: U3.10 13.64,19.49 12.94,19.49 10.1,22.34 10.1,23.24 9.25,24.09 7.28,24.09 v7.15,23.96 | R24.2 1.99,29.4 2.38,29.78 4.51,29.78 4.67,29.62 U5.5 v7.01,29.63 7.07,29.62 7.05,29.59 8.7,29.59 v10.29,31.18 | U1.29 15.24,40.7 v15.05,40.51
  Bottom 0.254: v7.15,23.96 7.18,23.99 7.18,29.4 7.02,29.55 v7.01,29.63 | v15.05,40.51 14.8,40.51 11.87,37.59 11.87,30.92 11.49,30.54 10.86,30.54 10.29,31.11 v10.29,31.18
TEST/SBWTCK
  Top 0.305: J2.17 38.03,48.25
  Top 0.406: IC1.17 38.1,29.72 38.61,30.23 38.61,47.69 38.06,48.23 J2.17
  Bottom 0.254: J3.9 36.64,45.72 38.1,47.18 J2.17
UCTS
  Top 0.254: U3.13 14.23,21.91 14.54,22.23 14.54,27.81 17.65,30.92 17.65,34.86 17.27,35.24 16.51,35.24 U1.18
UDSR
  Top 0.254: U3.14 12.97,22.71 12.64,23.05 12.64,24.96 14.03,26.35 14.03,28.07 16.19,30.23 16.19,34.7 U1.17
UDTR
  Top 0.254: U3.21 8.95,28.19 11.11,30.35 13.59,30.35 14.48,31.24 14.48,32.63 U1.16
URTS  (via drill 0.3)
  Top 0.254: U3.20 9.78,25.83 9.78,26.61 10.16,26.99 v10.16,27.05 | U1.15 13.97,31.88 v13.14,31.05
  Bottom 0.254: v10.16,27.05 11.24,28.13 11.24,29.4 v13.14,31.05
URXD
  Top 0.254: U3.19 10.56,26.37 10.86,26.67 12.26,26.67 13.02,27.43 13.02,28.57 15.18,30.73 15.18,33.8 13.91,35.06 13.91,42.1 14.46,42.66 U1.33
UTXD
  Top 0.254: U3.17 12.68,26.33 12.69,26.33 13.53,27.16 13.53,28.32 15.68,30.48 15.68,33.97 14.41,35.24 14.41,41.92 14.69,42.2 U1.32
VCC
  Top 0.254: R34.1 25.84,8.06 27.43,9.65 27.43,9.93 C20.2 | R27.1 27.43,15.37 27.43,12.61 C23.2
  Top 0.406: C23.2 30.45,12.61 30.48,14.16 | C20.2 30.45,9.94 30.48,11.43 | J3.1 27.94,30.48 27.94,27.88 30.45,25.37 | 30.45,25.37 30.48,25.34 IC1.1 30.48,14.16 | J6.1 55.88,40.64 55.88,27.94 53.34,25.4 30.48,25.4 30.45,25.37 | 30.48,11.43 J1.1 | 30.48,11.43 30.48,14.16
XIN
  Top 0.406: R29.2 31.71,41.3 33.02,42.61 J2.19
XIN1
  Top 0.254: C3.1 7.81,48.01 7.79,48.02 6.78,48.02 6.6,48.01 6.6,47.62 6.48,47.75 Q1.P$3 6.28,48.45 5.78,48.45 5.02,47.69 5.02,44.7 6.29,43.43 6.29,41.08 5.9,40.7 U1.52
XINR
  Top 0.406: IC1.19 33.02,31.69 31.56,33.15 31.56,34.38 Q2.2 31.55,34.34 31.6,34.39 C21.2 31.45,36.89 31.11,36.89 30.54,37.47 30.54,39.18 31.09,39.73 R29.1
XOUT
  Top 0.406: R28.2 36.42,41.3 35.56,42.16 J2.18
XOUT1
  Top 0.254: C2.1 1.06,46.44 1.46,46.04 2.81,46.03 Q1.P$1 3.75,45.09 3.75,40.58 4.12,40.2 U1.53
XOUTR
  Top 0.406: IC1.18 35.56,31.75 36.58,32.77 36.58,34.36 Q2.1 36.66,34.4 36.6,34.46 C22.2 36.71,36.89 37.15,36.89 37.66,37.4 37.66,39.12 37.05,39.73 R28.1

### Text on the board
tPlace: TEST | GND | RST | XIN | XOUT | TEST | P1.7 | P2.5 | P2.4 | P2.3 | RXD | TXD | (S1) RST | VCC | RESET | 1 | (LED2) P1.6 | 14pin | 20pin | N14 | N20 | 1 | Rev.1.3 | EMULATION | P1.6 | MSP-EXP430G2 | P1.0 | PWR | P1.3 | VCC | P1.0 (LED1) | P1.1 (TXD) | P1.2 (RXD) | P1.3 (S2) | P1.4 | P1.5 | P2.0 | P2.1 | P2.2
tNames: GND | GND | VCC | S1 | S2 | RoHS
Measures: 50.0 mm | 66.0 mm